# EAGLE design mbi6651 (EAGLE 5.11)
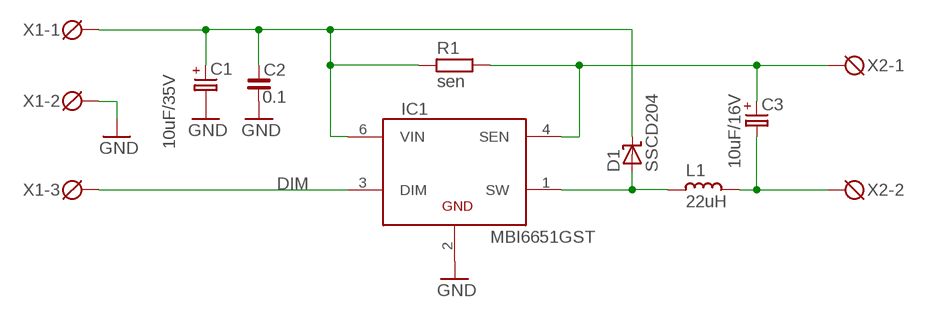
[diagram p0: schematic, sheet 1]

## Parts
C1  10uF/35V  CP_SMCB  [SMC_B]
C2  0.1  C_0805  [C0805]
C3  10uF/16V  CP_SMCB  [SMC_B]
D1  SSCD204  SD-SOD123  [SOD123]
IC1  MBI6651GST  [SOT23-6L]
L1  22uH  L_PM1812  [PM1812]
R1  sen  R_0805  [R0805]
X1  DG3XX-03-3.5  [DG350-3.5-03P]
X2  DG3XX-02-3.5  [DG350-3.5-02P]

## Nets
DIM: IC1.3(DIM) X1.3
GND: C1.- C2.2 IC1.2(GND) X1.2
N$1: C1.+ C2.1 D1.C IC1.6(VIN) R1.1 X1.1
N$2: C3.+ IC1.4(SEN) R1.2 X2.1
N$3: D1.A IC1.1(SW) L1.2
N$5: C3.- L1.1 X2.2

## Library data of the parts
C1 C3 = rc-master-smd:CP_: POLARIZED CAP
C2 = rc-master-smd:C_: NON-POLARIZED CAP
D1 = diodes:SD-: Schottky diode
IC1 = led:MBI6651: Step-Down, 1A LED Driver Features Backward compatible with MBI6650 in package 1A constant output current 96% efficiency @ input voltage 12V, 350mA, 3-LED 9~36V input voltage range Hysteretic PFM improves efficiency at light loading Settable output current Integrated power switch with 0.45ohm low Rds(on) Full protection: Thermal/UVLO/Start-Up/LED Open-/Short- Circuit Only 4 external components required
L1 = rc-master-smd:L_: INDUCTOR
R1 = rc-master-smd:R_: RESISTOR
X1 = degson:DG3XX-03: DG350-3.5-03P DG306-5.0-03P
X2 = degson:DG3XX-02: DG350-3.5-02P DG306-5.0-02P

## Board
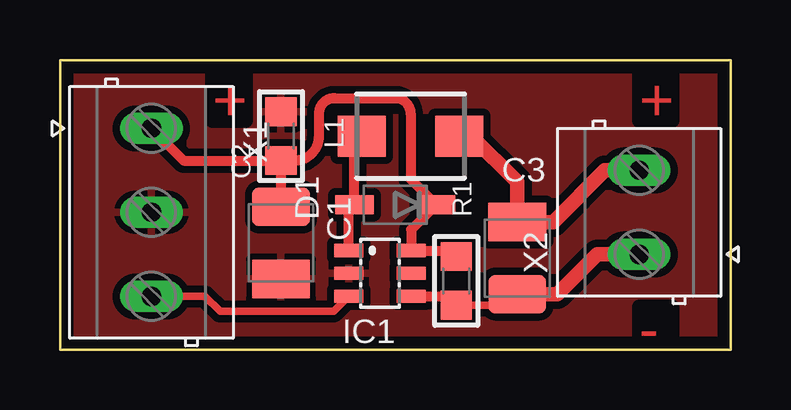
[diagram p1: board, top side]

Size 27.94 x 12.06 mm. Coordinates in mm from the lower left corner, seen from the top.
Outline: 0,0 27.94,0 27.94,12.06 0,12.06 0,0
Copper layers (1*16): Top 0.035mm / dielectric 1.5mm / Bottom 0.035mm
Design rules "default *": minimum track width 10mil, minimum drill 24mil, track to track 8mil, track to pad 8mil, pad to pad 8mil, via to via 8mil, smd to smd 8mil, copper to edge 0.5mm, drill to drill 8mil, minimum pad ring 10mil, minimum via ring 8mil, stop-mask expansion 4mil, vias tented up to drill 0mil, thermal gap 10mil

### Footprints (pad centres in the part's own frame; a part is rotated, then mirrored left to right if it is on the bottom)
SMC_B = smd 1.6 x 2.4: + -1.5,0; - 1.5,0
C0805 = smd 1.2 x 1.3: 1 -1.016,0; 2 1.016,0
SOD123 = smd 1.6 x 0.8: A 1.7,0; C -1.7,0
SOT23-6L = smd 0.55 x 1.2: 1 -0.95,-1.3; 2 0,-1.3; 3 0.95,-1.3; 4 0.95,1.3; 5 0,1.3; 6 -0.95,1.3
PM1812 = smd 2 x 1.7: 1 -2.032,0; 2 2.032,0
R0805 = smd 1.2 x 1.3: 1 -1.016,0; 2 1.016,0
DG350-3.5-03P = drill 0.8 long: 1 -3.5,0; 2 0,0; 3 3.5,0
DG350-3.5-02P = drill 0.8 long: 1 -1.75,0; 2 1.75,0

### Placement (x,y rotation side)
C1  9.21,4.45 270 top
C2  9.21,8.89 90 top
C3  19.05,3.81 90 top
D1  13.97,6.03 180 top
IC1  13.34,3.17 270 top
L1  14.61,8.89 180 top
R1  16.51,2.86 270 top
X1  3.81,5.71 270 top
X2  24.13,5.71 90 top

### Tracks (layer width: path | path; a pad name or v marks a point on that pad's centre or on a via)
DIM
  Top 0.305: X1.3 6.04,2.21 6.67,1.59 11.4,1.59 IC1.3
GND
  pour Top (isolate 0.305): 0,11.43 27.94,11.43 27.94,0 0,0
N$1
  Top 0.305: 16.44,4.12 R1.1
  Top 0.406: 16.44,4.12 IC1.6 14.63,5 D1.C 14.61,7.1 14.61,9.84 arc90 13.97,10.48 11.43,10.48 arc90 10.79,9.84 10.79,8.89 arc-90 9.78,7.87 9.53,7.87 | X1.1 5.15,7.87 C2.1 9.53,7.87 | C1.+ 9.21,7.56 9.53,7.87
N$2
  Top 0.305: R1.2 18.58,1.84 C3.+
  Top 0.406: IC1.4 16.44,2.23 R1.2
  Top 0.61: C3.+ 20.73,2.31 22.38,3.96 X2.1
N$3
  Top 0.406: L1.2 12.27,8.59 D1.A 12.04,5.8 IC1.1
N$5
  Top 0.61: L1.1 17.14,8.89 19.05,6.99 C3.- 20.55,5.31 22.7,7.46 X2.2

### Text on the board
Top: + | + | -